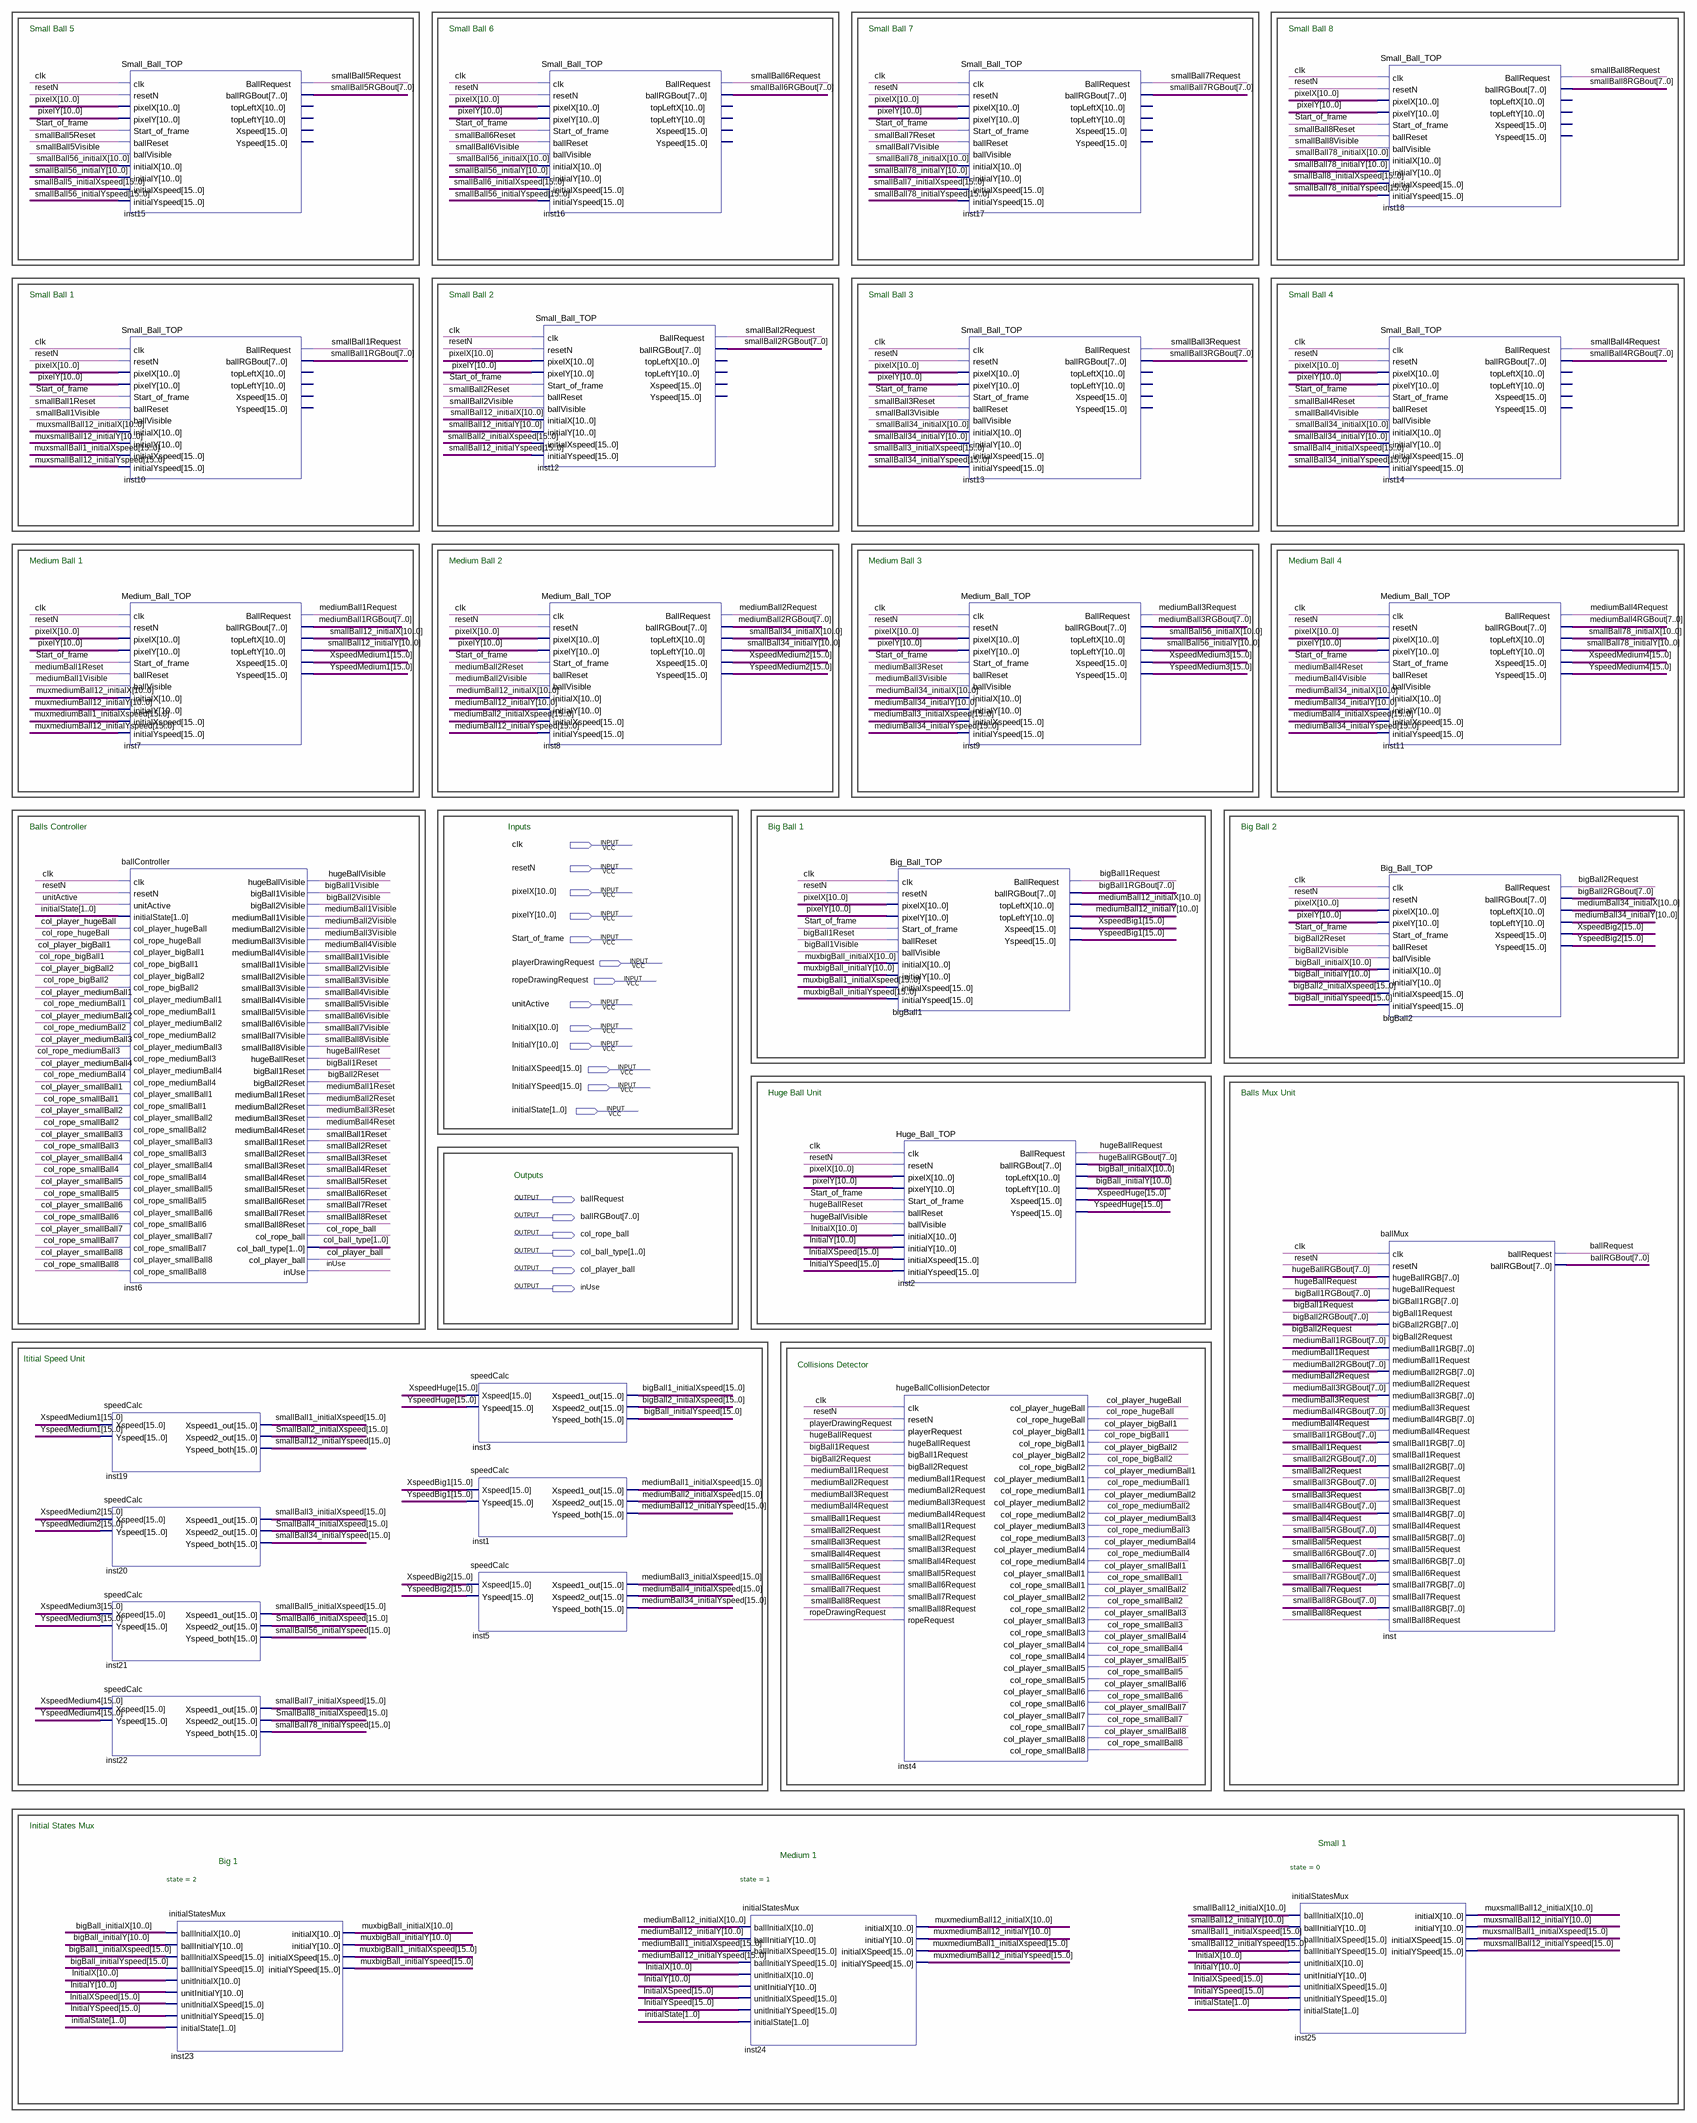
[diagram p0: schematic sheet]
// Quartus schematic balls_TOP.bdf as structural Verilog: 28 symbols, 19 pins
module balls_TOP (
  input  clk,
  input  resetN,
  input  [10:0] pixelX,
  input  [10:0] pixelY,
  input  Start_of_frame,
  input  playerDrawingRequest,
  input  ropeDrawingRequest,
  input  unitActive,
  input  [10:0] InitialX,
  input  [10:0] InitialY,
  input  [15:0] InitialXSpeed,
  input  [15:0] InitialYSpeed,
  input  [1:0] initialState,
  output ballRequest,
  output [7:0] ballRGBout,
  output col_rope_ball,
  output [1:0] col_ball_type,
  output col_player_ball,
  output inUse
);

  wire bigBall1Request, bigBall1Reset, bigBall1Visible, bigBall2Request, bigBall2Reset, bigBall2Visible,
       col_player_bigBall1, col_player_bigBall2, col_player_hugeBall, col_player_mediumBall1,
       col_player_mediumBall2, col_player_mediumBall3, col_player_mediumBall4, col_player_smallBall1,
       col_player_smallBall2, col_player_smallBall3, col_player_smallBall4, col_player_smallBall5,
       col_player_smallBall6, col_player_smallBall7, col_player_smallBall8, col_rope_bigBall1,
       col_rope_bigBall2, col_rope_hugeBall, col_rope_mediumBall1, col_rope_mediumBall2,
       col_rope_mediumBall3, col_rope_mediumBall4, col_rope_smallBall1, col_rope_smallBall2,
       col_rope_smallBall3, col_rope_smallBall4, col_rope_smallBall5, col_rope_smallBall6,
       col_rope_smallBall7, col_rope_smallBall8, hugeBallRequest, hugeBallReset, hugeBallVisible,
       mediumBall1Request, mediumBall1Reset, mediumBall1Visible, mediumBall2Request, mediumBall2Reset,
       mediumBall2Visible, mediumBall3Request, mediumBall3Reset, mediumBall3Visible, mediumBall4Request,
       mediumBall4Reset, mediumBall4Visible, smallBall1Request, smallBall1Reset, smallBall1Visible,
       smallBall2Request, smallBall2Reset, smallBall2Visible, smallBall3Request, smallBall3Reset,
       smallBall3Visible, smallBall4Request, smallBall4Reset, smallBall4Visible, smallBall5Request,
       smallBall5Reset, smallBall5Visible, smallBall6Request, smallBall6Reset, smallBall6Visible,
       smallBall7Request, smallBall7Reset, smallBall7Visible, smallBall8Request, smallBall8Reset,
       smallBall8Visible;
  wire [7:0] bigBall1RGBout, bigBall2RGBout, hugeBallRGBout, mediumBall1RGBout, mediumBall2RGBout,
       mediumBall3RGBout, mediumBall4RGBout, smallBall1RGBout, smallBall2RGBout, smallBall3RGBout,
       smallBall4RGBout, smallBall5RGBout, smallBall6RGBout, smallBall7RGBout, smallBall8RGBout;
  wire [10:0] bigBall_initialX, bigBall_initialY, mediumBall12_initialX, mediumBall12_initialY,
       mediumBall34_initialX, mediumBall34_initialY, muxbigBall_initialX, muxbigBall_initialY,
       muxmediumBall12_initialX, muxmediumBall12_initialY, muxsmallBall12_initialX, muxsmallBall12_initialY,
       smallBall12_initialX, smallBall12_initialY, smallBall34_initialX, smallBall34_initialY,
       smallBall56_initialX, smallBall56_initialY, smallBall78_initialX, smallBall78_initialY;
  wire [15:0] bigBall1_initialXspeed, bigBall2_initialXspeed, bigBall_initialYspeed,
       mediumBall1_initialXspeed, mediumBall2_initialXspeed, mediumBall3_initialXspeed,
       mediumBall4_initialXspeed, mediumBall12_initialYspeed, mediumBall34_initialYspeed,
       muxbigBall1_initialXspeed, muxbigBall_initialYspeed, muxmediumBall1_initialXspeed,
       muxmediumBall12_initialYspeed, muxsmallBall1_initialXspeed, muxsmallBall12_initialYspeed,
       smallBall1_initialXspeed, SmallBall2_initialXspeed, smallBall3_initialXspeed,
       smallBall4_initialXspeed, smallBall5_initialXspeed, smallBall6_initialXspeed,
       smallBall7_initialXspeed, smallBall8_initialXspeed, smallBall12_initialYspeed,
       smallBall34_initialYspeed, smallBall56_initialYspeed, smallBall78_initialYspeed, XspeedBig1,
       XspeedBig2, XspeedHuge, XspeedMedium1, XspeedMedium2, XspeedMedium3, XspeedMedium4, YspeedBig1,
       YspeedBig2, YspeedHuge, YspeedMedium1, YspeedMedium2, YspeedMedium3, YspeedMedium4;

  Small_Ball_TOP inst15 (
    .clk(clk), .resetN(resetN), .pixelX(pixelX), .pixelY(pixelY), .Start_of_frame(Start_of_frame),
    .ballReset(smallBall5Reset), .ballVisible(smallBall5Visible), .initialX(smallBall56_initialX),
    .initialY(smallBall56_initialY), .initialXspeed(smallBall5_initialXspeed),
    .initialYspeed(smallBall56_initialYspeed), .BallRequest(smallBall5Request), .ballRGBout(smallBall5RGBout));  // open: topLeftX, topLeftY, Xspeed, Yspeed
  Small_Ball_TOP inst10 (
    .clk(clk), .resetN(resetN), .pixelX(pixelX), .pixelY(pixelY), .Start_of_frame(Start_of_frame),
    .ballReset(smallBall1Reset), .ballVisible(smallBall1Visible), .initialX(muxsmallBall12_initialX),
    .initialY(muxsmallBall12_initialY), .initialXspeed(muxsmallBall1_initialXspeed),
    .initialYspeed(muxsmallBall12_initialYspeed), .BallRequest(smallBall1Request),
    .ballRGBout(smallBall1RGBout));  // open: topLeftX, topLeftY, Xspeed, Yspeed
  Medium_Ball_TOP inst7 (
    .clk(clk), .resetN(resetN), .pixelX(pixelX), .pixelY(pixelY), .Start_of_frame(Start_of_frame),
    .ballReset(mediumBall1Reset), .ballVisible(mediumBall1Visible), .initialX(muxmediumBall12_initialX),
    .initialY(muxmediumBall12_initialY), .initialXspeed(muxmediumBall1_initialXspeed),
    .initialYspeed(muxmediumBall12_initialYspeed), .BallRequest(mediumBall1Request),
    .ballRGBout(mediumBall1RGBout), .topLeftX(smallBall12_initialX), .topLeftY(smallBall12_initialY),
    .Xspeed(XspeedMedium1), .Yspeed(YspeedMedium1));
  ballController inst6 (
    .clk(clk), .resetN(resetN), .unitActive(unitActive), .initialState(initialState),
    .col_player_hugeBall(col_player_hugeBall), .col_rope_hugeBall(col_rope_hugeBall),
    .col_player_bigBall1(col_player_bigBall1), .col_rope_bigBall1(col_rope_bigBall1),
    .col_player_bigBall2(col_player_bigBall2), .col_rope_bigBall2(col_rope_bigBall2),
    .col_player_mediumBall1(col_player_mediumBall1), .col_rope_mediumBall1(col_rope_mediumBall1),
    .col_player_mediumBall2(col_player_mediumBall2), .col_rope_mediumBall2(col_rope_mediumBall2),
    .col_player_mediumBall3(col_player_mediumBall3), .col_rope_mediumBall3(col_rope_mediumBall3),
    .col_player_mediumBall4(col_player_mediumBall4), .col_rope_mediumBall4(col_rope_mediumBall4),
    .col_player_smallBall1(col_player_smallBall1), .col_rope_smallBall1(col_rope_smallBall1),
    .col_player_smallBall2(col_player_smallBall2), .col_rope_smallBall2(col_rope_smallBall2),
    .col_player_smallBall3(col_player_smallBall3), .col_rope_smallBall3(col_rope_smallBall3),
    .col_player_smallBall4(col_player_smallBall4), .col_rope_smallBall4(col_rope_smallBall4),
    .col_player_smallBall5(col_player_smallBall5), .col_rope_smallBall5(col_rope_smallBall5),
    .col_player_smallBall6(col_player_smallBall6), .col_rope_smallBall6(col_rope_smallBall6),
    .col_player_smallBall7(col_player_smallBall7), .col_rope_smallBall7(col_rope_smallBall7),
    .col_player_smallBall8(col_player_smallBall8), .col_rope_smallBall8(col_rope_smallBall8),
    .hugeBallVisible(hugeBallVisible), .bigBall1Visible(bigBall1Visible), .bigBall2Visible(bigBall2Visible),
    .mediumBall1Visible(mediumBall1Visible), .mediumBall2Visible(mediumBall2Visible),
    .mediumBall3Visible(mediumBall3Visible), .mediumBall4Visible(mediumBall4Visible),
    .smallBall1Visible(smallBall1Visible), .smallBall2Visible(smallBall2Visible),
    .smallBall3Visible(smallBall3Visible), .smallBall4Visible(smallBall4Visible),
    .smallBall5Visible(smallBall5Visible), .smallBall6Visible(smallBall6Visible),
    .smallBall7Visible(smallBall7Visible), .smallBall8Visible(smallBall8Visible),
    .hugeBallReset(hugeBallReset), .bigBall1Reset(bigBall1Reset), .bigBall2Reset(bigBall2Reset),
    .mediumBall1Reset(mediumBall1Reset), .mediumBall2Reset(mediumBall2Reset),
    .mediumBall3Reset(mediumBall3Reset), .mediumBall4Reset(mediumBall4Reset),
    .smallBall1Reset(smallBall1Reset), .smallBall2Reset(smallBall2Reset), .smallBall3Reset(smallBall3Reset),
    .smallBall4Reset(smallBall4Reset), .smallBall5Reset(smallBall5Reset), .smallBall6Reset(smallBall6Reset),
    .smallBall7Reset(smallBall7Reset), .smallBall8Reset(smallBall8Reset), .col_rope_ball(col_rope_ball),
    .col_ball_type(col_ball_type), .col_player_ball(col_player_ball), .inUse(inUse));
  speedCalc inst19 (
    .Xspeed(XspeedMedium1), .Yspeed(YspeedMedium1), .Xspeed1_out(smallBall1_initialXspeed),
    .Xspeed2_out(SmallBall2_initialXspeed), .Yspeed_both(smallBall12_initialYspeed));
  speedCalc inst20 (
    .Xspeed(XspeedMedium2), .Yspeed(YspeedMedium2), .Xspeed1_out(smallBall3_initialXspeed),
    .Xspeed2_out(smallBall4_initialXspeed), .Yspeed_both(smallBall34_initialYspeed));
  speedCalc inst21 (
    .Xspeed(XspeedMedium3), .Yspeed(YspeedMedium3), .Xspeed1_out(smallBall5_initialXspeed),
    .Xspeed2_out(smallBall6_initialXspeed), .Yspeed_both(smallBall56_initialYspeed));
  speedCalc inst22 (
    .Xspeed(XspeedMedium4), .Yspeed(YspeedMedium4), .Xspeed1_out(smallBall7_initialXspeed),
    .Xspeed2_out(smallBall8_initialXspeed), .Yspeed_both(smallBall78_initialYspeed));
  initialStatesMux #(.state(2)) inst23 (
    .ballInitialX(bigBall_initialX), .ballInitialY(bigBall_initialY),
    .ballInitialXSpeed(bigBall1_initialXspeed), .ballInitialYSpeed(bigBall_initialYspeed),
    .unitInitialX(InitialX), .unitInitialY(InitialY), .unitInitialXSpeed(InitialXSpeed),
    .unitInitialYSpeed(InitialYSpeed), .initialState(initialState), .initialX(muxbigBall_initialX),
    .initialY(muxbigBall_initialY), .initialXSpeed(muxbigBall1_initialXspeed),
    .initialYSpeed(muxbigBall_initialYspeed));
  speedCalc inst3 (
    .Xspeed(XspeedHuge), .Yspeed(YspeedHuge), .Xspeed1_out(bigBall1_initialXspeed),
    .Xspeed2_out(bigBall2_initialXspeed), .Yspeed_both(bigBall_initialYspeed));
  speedCalc inst1 (
    .Xspeed(XspeedBig1), .Yspeed(YspeedBig1), .Xspeed1_out(mediumBall1_initialXspeed),
    .Xspeed2_out(mediumBall2_initialXspeed), .Yspeed_both(mediumBall12_initialYspeed));
  speedCalc inst5 (
    .Xspeed(XspeedBig2), .Yspeed(YspeedBig2), .Xspeed1_out(mediumBall3_initialXspeed),
    .Xspeed2_out(mediumBall4_initialXspeed), .Yspeed_both(mediumBall34_initialYspeed));
  Small_Ball_TOP inst16 (
    .clk(clk), .resetN(resetN), .pixelX(pixelX), .pixelY(pixelY), .Start_of_frame(Start_of_frame),
    .ballReset(smallBall6Reset), .ballVisible(smallBall6Visible), .initialX(smallBall56_initialX),
    .initialY(smallBall56_initialY), .initialXspeed(smallBall6_initialXspeed),
    .initialYspeed(smallBall56_initialYspeed), .BallRequest(smallBall6Request), .ballRGBout(smallBall6RGBout));  // open: topLeftX, topLeftY, Xspeed, Yspeed
  Small_Ball_TOP inst12 (
    .clk(clk), .resetN(resetN), .pixelX(pixelX), .pixelY(pixelY), .Start_of_frame(Start_of_frame),
    .ballReset(smallBall2Reset), .ballVisible(smallBall2Visible), .initialX(smallBall12_initialX),
    .initialY(smallBall12_initialY), .initialXspeed(SmallBall2_initialXspeed),
    .initialYspeed(smallBall12_initialYspeed), .BallRequest(smallBall2Request), .ballRGBout(smallBall2RGBout));  // open: topLeftX, topLeftY, Xspeed, Yspeed
  Medium_Ball_TOP inst8 (
    .clk(clk), .resetN(resetN), .pixelX(pixelX), .pixelY(pixelY), .Start_of_frame(Start_of_frame),
    .ballReset(mediumBall2Reset), .ballVisible(mediumBall2Visible), .initialX(mediumBall12_initialX),
    .initialY(mediumBall12_initialY), .initialXspeed(mediumBall2_initialXspeed),
    .initialYspeed(mediumBall12_initialYspeed), .BallRequest(mediumBall2Request),
    .ballRGBout(mediumBall2RGBout), .topLeftX(smallBall34_initialX), .topLeftY(smallBall34_initialY),
    .Xspeed(XspeedMedium2), .Yspeed(YspeedMedium2));
  initialStatesMux #(.state(1)) inst24 (
    .ballInitialX(mediumBall12_initialX), .ballInitialY(mediumBall12_initialY),
    .ballInitialXSpeed(mediumBall1_initialXspeed), .ballInitialYSpeed(mediumBall12_initialYspeed),
    .unitInitialX(InitialX), .unitInitialY(InitialY), .unitInitialXSpeed(InitialXSpeed),
    .unitInitialYSpeed(InitialYSpeed), .initialState(initialState), .initialX(muxmediumBall12_initialX),
    .initialY(muxmediumBall12_initialY), .initialXSpeed(muxmediumBall1_initialXspeed),
    .initialYSpeed(muxmediumBall12_initialYspeed));
  Big_Ball_TOP bigBall1 (
    .clk(clk), .resetN(resetN), .pixelX(pixelX), .pixelY(pixelY), .Start_of_frame(Start_of_frame),
    .ballReset(bigBall1Reset), .ballVisible(bigBall1Visible), .initialX(muxbigBall_initialX),
    .initialY(muxbigBall_initialY), .initialXspeed(muxbigBall1_initialXspeed),
    .initialYspeed(muxbigBall_initialYspeed), .BallRequest(bigBall1Request), .ballRGBout(bigBall1RGBout),
    .topLeftX(mediumBall12_initialX), .topLeftY(mediumBall12_initialY), .Xspeed(XspeedBig1),
    .Yspeed(YspeedBig1));
  Huge_Ball_TOP inst2 (
    .clk(clk), .resetN(resetN), .pixelX(pixelX), .pixelY(pixelY), .Start_of_frame(Start_of_frame),
    .ballReset(hugeBallReset), .ballVisible(hugeBallVisible), .initialX(InitialX), .initialY(InitialY),
    .initialXspeed(InitialXSpeed), .initialYspeed(InitialYSpeed), .BallRequest(hugeBallRequest),
    .ballRGBout(hugeBallRGBout), .topLeftX(bigBall_initialX), .topLeftY(bigBall_initialY),
    .Xspeed(XspeedHuge), .Yspeed(YspeedHuge));
  hugeBallCollisionDetector inst4 (
    .clk(clk), .resetN(resetN), .playerRequest(playerDrawingRequest), .hugeBallRequest(hugeBallRequest),
    .bigBall1Request(bigBall1Request), .bigBall2Request(bigBall2Request),
    .mediumBall1Request(mediumBall1Request), .mediumBall2Request(mediumBall2Request),
    .mediumBall3Request(mediumBall3Request), .mediumBall4Request(mediumBall4Request),
    .smallBall1Request(smallBall1Request), .smallBall2Request(smallBall2Request),
    .smallBall3Request(smallBall3Request), .smallBall4Request(smallBall4Request),
    .smallBall5Request(smallBall5Request), .smallBall6Request(smallBall6Request),
    .smallBall7Request(smallBall7Request), .smallBall8Request(smallBall8Request),
    .ropeRequest(ropeDrawingRequest), .col_player_hugeBall(col_player_hugeBall),
    .col_rope_hugeBall(col_rope_hugeBall), .col_player_bigBall1(col_player_bigBall1),
    .col_rope_bigBall1(col_rope_bigBall1), .col_player_bigBall2(col_player_bigBall2),
    .col_rope_bigBall2(col_rope_bigBall2), .col_player_mediumBall1(col_player_mediumBall1),
    .col_rope_mediumBall1(col_rope_mediumBall1), .col_player_mediumBall2(col_player_mediumBall2),
    .col_rope_mediumBall2(col_rope_mediumBall2), .col_player_mediumBall3(col_player_mediumBall3),
    .col_rope_mediumBall3(col_rope_mediumBall3), .col_player_mediumBall4(col_player_mediumBall4),
    .col_rope_mediumBall4(col_rope_mediumBall4), .col_player_smallBall1(col_player_smallBall1),
    .col_rope_smallBall1(col_rope_smallBall1), .col_player_smallBall2(col_player_smallBall2),
    .col_rope_smallBall2(col_rope_smallBall2), .col_player_smallBall3(col_player_smallBall3),
    .col_rope_smallBall3(col_rope_smallBall3), .col_player_smallBall4(col_player_smallBall4),
    .col_rope_smallBall4(col_rope_smallBall4), .col_player_smallBall5(col_player_smallBall5),
    .col_rope_smallBall5(col_rope_smallBall5), .col_player_smallBall6(col_player_smallBall6),
    .col_rope_smallBall6(col_rope_smallBall6), .col_player_smallBall7(col_player_smallBall7),
    .col_rope_smallBall7(col_rope_smallBall7), .col_player_smallBall8(col_player_smallBall8),
    .col_rope_smallBall8(col_rope_smallBall8));
  Small_Ball_TOP inst17 (
    .clk(clk), .resetN(resetN), .pixelX(pixelX), .pixelY(pixelY), .Start_of_frame(Start_of_frame),
    .ballReset(smallBall7Reset), .ballVisible(smallBall7Visible), .initialX(smallBall78_initialX),
    .initialY(smallBall78_initialY), .initialXspeed(smallBall7_initialXspeed),
    .initialYspeed(smallBall78_initialYspeed), .BallRequest(smallBall7Request), .ballRGBout(smallBall7RGBout));  // open: topLeftX, topLeftY, Xspeed, Yspeed
  Small_Ball_TOP inst13 (
    .clk(clk), .resetN(resetN), .pixelX(pixelX), .pixelY(pixelY), .Start_of_frame(Start_of_frame),
    .ballReset(smallBall3Reset), .ballVisible(smallBall3Visible), .initialX(smallBall34_initialX),
    .initialY(smallBall34_initialY), .initialXspeed(smallBall3_initialXspeed),
    .initialYspeed(smallBall34_initialYspeed), .BallRequest(smallBall3Request), .ballRGBout(smallBall3RGBout));  // open: topLeftX, topLeftY, Xspeed, Yspeed
  Medium_Ball_TOP inst9 (
    .clk(clk), .resetN(resetN), .pixelX(pixelX), .pixelY(pixelY), .Start_of_frame(Start_of_frame),
    .ballReset(mediumBall3Reset), .ballVisible(mediumBall3Visible), .initialX(mediumBall34_initialX),
    .initialY(mediumBall34_initialY), .initialXspeed(mediumBall3_initialXspeed),
    .initialYspeed(mediumBall34_initialYspeed), .BallRequest(mediumBall3Request),
    .ballRGBout(mediumBall3RGBout), .topLeftX(smallBall56_initialX), .topLeftY(smallBall56_initialY),
    .Xspeed(XspeedMedium3), .Yspeed(YspeedMedium3));
  initialStatesMux #(.state(0)) inst25 (
    .ballInitialX(smallBall12_initialX), .ballInitialY(smallBall12_initialY),
    .ballInitialXSpeed(smallBall1_initialXspeed), .ballInitialYSpeed(smallBall12_initialYspeed),
    .unitInitialX(InitialX), .unitInitialY(InitialY), .unitInitialXSpeed(InitialXSpeed),
    .unitInitialYSpeed(InitialYSpeed), .initialState(initialState), .initialX(muxsmallBall12_initialX),
    .initialY(muxsmallBall12_initialY), .initialXSpeed(muxsmallBall1_initialXspeed),
    .initialYSpeed(muxsmallBall12_initialYspeed));
  Small_Ball_TOP inst18 (
    .clk(clk), .resetN(resetN), .pixelX(pixelX), .pixelY(pixelY), .Start_of_frame(Start_of_frame),
    .ballReset(smallBall8Reset), .ballVisible(smallBall8Visible), .initialX(smallBall78_initialX),
    .initialY(smallBall78_initialY), .initialXspeed(smallBall8_initialXspeed),
    .initialYspeed(smallBall78_initialYspeed), .BallRequest(smallBall8Request), .ballRGBout(smallBall8RGBout));  // open: topLeftX, topLeftY, Xspeed, Yspeed
  Small_Ball_TOP inst14 (
    .clk(clk), .resetN(resetN), .pixelX(pixelX), .pixelY(pixelY), .Start_of_frame(Start_of_frame),
    .ballReset(smallBall4Reset), .ballVisible(smallBall4Visible), .initialX(smallBall34_initialX),
    .initialY(smallBall34_initialY), .initialXspeed(smallBall4_initialXspeed),
    .initialYspeed(smallBall34_initialYspeed), .BallRequest(smallBall4Request), .ballRGBout(smallBall4RGBout));  // open: topLeftX, topLeftY, Xspeed, Yspeed
  Medium_Ball_TOP inst11 (
    .clk(clk), .resetN(resetN), .pixelX(pixelX), .pixelY(pixelY), .Start_of_frame(Start_of_frame),
    .ballReset(mediumBall4Reset), .ballVisible(mediumBall4Visible), .initialX(mediumBall34_initialX),
    .initialY(mediumBall34_initialY), .initialXspeed(mediumBall4_initialXspeed),
    .initialYspeed(mediumBall34_initialYspeed), .BallRequest(mediumBall4Request),
    .ballRGBout(mediumBall4RGBout), .topLeftX(smallBall78_initialX), .topLeftY(smallBall78_initialY),
    .Xspeed(XspeedMedium4), .Yspeed(YspeedMedium4));
  Big_Ball_TOP bigBall2 (
    .clk(clk), .resetN(resetN), .pixelX(pixelX), .pixelY(pixelY), .Start_of_frame(Start_of_frame),
    .ballReset(bigBall2Reset), .ballVisible(bigBall2Visible), .initialX(bigBall_initialX),
    .initialY(bigBall_initialY), .initialXspeed(bigBall2_initialXspeed),
    .initialYspeed(bigBall_initialYspeed), .BallRequest(bigBall2Request), .ballRGBout(bigBall2RGBout),
    .topLeftX(mediumBall34_initialX), .topLeftY(mediumBall34_initialY), .Xspeed(XspeedBig2),
    .Yspeed(YspeedBig2));
  ballMux inst (
    .clk(clk), .resetN(resetN), .hugeBallRGB(hugeBallRGBout), .hugeBallRequest(hugeBallRequest),
    .biGBall1RGB(bigBall1RGBout), .bigBall1Request(bigBall1Request), .biGBall2RGB(bigBall2RGBout),
    .bigBall2Request(bigBall2Request), .mediumBall1RGB(mediumBall1RGBout),
    .mediumBall1Request(mediumBall1Request), .mediumBall2RGB(mediumBall2RGBout),
    .mediumBall2Request(mediumBall2Request), .mediumBall3RGB(mediumBall3RGBout),
    .mediumBall3Request(mediumBall3Request), .mediumBall4RGB(mediumBall4RGBout),
    .mediumBall4Request(mediumBall4Request), .smallBall1RGB(smallBall1RGBout),
    .smallBall1Request(smallBall1Request), .smallBall2RGB(smallBall2RGBout),
    .smallBall2Request(smallBall2Request), .smallBall3RGB(smallBall3RGBout),
    .smallBall3Request(smallBall3Request), .smallBall4RGB(smallBall4RGBout),
    .smallBall4Request(smallBall4Request), .smallBall5RGB(smallBall5RGBout),
    .smallBall5Request(smallBall5Request), .smallBall6RGB(smallBall6RGBout),
    .smallBall6Request(smallBall6Request), .smallBall7RGB(smallBall7RGBout),
    .smallBall7Request(smallBall7Request), .smallBall8RGB(smallBall8RGBout),
    .smallBall8Request(smallBall8Request), .ballRequest(ballRequest), .ballRGBout(ballRGBout));

  // Notes on the sheet:
  //   Small Ball 5
  //   Small Ball 6
  //   Small Ball 7
  //   Small Ball 8
  //   Small Ball 1
  //   Small Ball 2
  //   Small Ball 3
  //   Small Ball 4
  //   Medium Ball 1
  //   Medium Ball 2
  //   Medium Ball 3
  //   Medium Ball 4
  //   Balls Controller
  //   Inputs
  //   Big Ball 1
  //   Big Ball 2
  //   Huge Ball Unit
  //   Balls Mux Unit
  //   Outputs
  //   Ititial Speed Unit
  //   Collisions Detector
  //   Initial States Mux
  //   Small 1
  //   Medium 1
  //   Big 1
endmodule
